# Altium schematic sheet PSU.SchDoc: Power Supply
size 297 x 209 mm; DocumentNumber: SP-0333; SheetNumber: 3; SheetTotal: 5
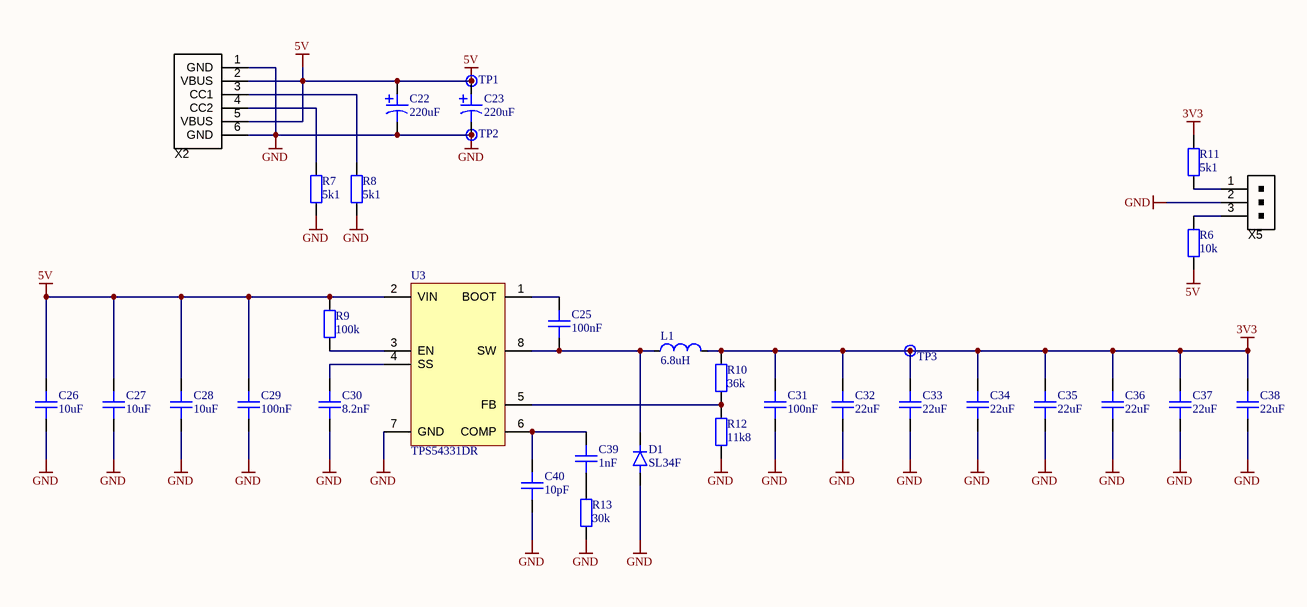
[diagram p0: PSU.SchDoc]

## Parts
C22  220uF  [CAP-TANT-D]
C23  220uF  [CAP-TANT-D]
C25  100nF  [CAP-0603]
C26  10uF  [CAP-0805]
C27  10uF  [CAP-0805]
C28  10uF  [CAP-0805]
C29  100nF  [CAP-0805]
C30  8.2nF  [CAP-0603]
C31  100nF  [CAP-0805]
C32  22uF  [CAP-0805]
C33  22uF  [CAP-0805]
C34  22uF  [CAP-0805]
C35  22uF  [CAP-0805]
C36  22uF  [CAP-0805]
C37  22uF  [CAP-0805]
C38  22uF  [CAP-0805]
C39  1nF  [CAP-0603]
C40  10pF  [CAP-0603]
D1  SL34F  [D-SMAF]
L1  6.8uH  [IND-SMD-6.5x6.5mm]
R6  10k  [RES-0603]
R7  5k1  [RES-0603]
R8  5k1  [RES-0603]
R9  100k  [RES-0603]
R10  36k  [RES-0603]
R11  5k1  [RES-0603]
R12  11k8  [RES-0603]
R13  30k  [RES-0603]
TP1  MISC - Testpoint SMT  [MISC-TESTPOINT-SMT]  (value not drawn)  (no BOM)
TP2  MISC - Testpoint SMT  [MISC-TESTPOINT-SMT]  (value not drawn)  (no BOM)
TP3  MISC - Testpoint SMT  [MISC-TESTPOINT-SMT]  (value not drawn)  (no BOM)
U3  TPS54331DR  [IC-SOIC-8]
X2  CONN - USB-C  [CONN-USB-C]  (value not drawn)
X5  CONN - 3P - THT-JST 1.5mm  [CONN-3P-THT-JST 1.5mm]  (value not drawn)

## Nets
3V3: C31.2 C32.2 C33.2 C34.2 C35.2 C36.2 C37.2 C38.2 L1.2 R10.2 R11.2 TP3.1
5V: C22.2 C23.2 C26.2 C27.2 C28.2 C29.2 R6.2 R9.1 TP1.1 U3.2(VIN) X2.2(VBUS) X2.5(VBUS)
GND: C22.1 C23.1 C26.1 C27.1 C28.1 C29.1 C30.1 C31.1 C32.1 C33.1 C34.1 C35.1 C36.1 C37.1 C38.1 C40.1 D1.1 R7.1 R8.1 R12.1 R13.1 TP2.1 U3.7(GND) X2.1(GND) X2.6(GND) X5.2
NetC25_1: C25.1 D1.2 L1.1 U3.8(SW)
NetC25_2: C25.2 U3.1(BOOT)
NetC30_2: C30.2 U3.4(SS)
NetC39_1: C39.1 R13.2
NetC39_2: C39.2 C40.2 U3.6(COMP)
NetR6_1: R6.1 X5.3
NetR7_2: R7.2 X2.4(CC2)
NetR8_2: R8.2 X2.3(CC1)
NetR9_2: R9.2 U3.3(EN)
NetR10_1: R10.1 R12.2 U3.5(FB)
NetR11_1: R11.1 X5.1

## Notes on the sheet
- PROJECT NAME
- DATE
- TITLE
- TIME
- VERSION CONTROL
- N/A
- SIZE
- SCALE:
- A4
- FILE NAME
- DWG NO.
- SHEET
- REV
- OF
- DRAWN BY:

## Library data of the parts
C22 C23 = CAP - TANT - D: Capacitor Polar; Distributor: Lomex; Order number: 92-01-29; Value: 220uF
C25 C30 C39 C40 = CAP - 0603: Capacitor Non-Polar; Distributor: *; Order number: *
  C25: Value: 100nF
  C30: Value: 8.2nF
  C39: Value: 1nF
  C40: Value: 10pF
C26-C29 C31-C38 = CAP - 0805: Capacitor Non-Polar; Distributor: *; Order number: *
  C26-C28: Value: 10uF
  C29 C31: Value: 100nF
  C32-C38: Value: 22uF
D1 = D - SL34F: 3A 600V DO-214AB RECT.SUP.FAST trr<35ns ES3J; PartNumber: SL34F; Distributor: Lomex; Order number: 83-07-60
L1 = IND - SMD: 12.7x12.7mm choke inductor; Order number: 100.434.72; 93-03-26; Value: 6.8uH; Distributor: Hestore; Lomex
R6-R13 = RES - 0603: Resistor; Distributor: *; Order number: *
  R6: Value: 10k
  R7 R8 R11: Value: 5k1
  R9: Value: 100k
  R10: Value: 36k
  R12: Value: 11k8
  R13: Value: 30k
TP1-TP3 = MISC - Testpoint SMT: SMT testpoint
U3 = IC - TPS54331: 3-A, 28-V Input, Step Down DC-DC Converter With Eco-mode; Order number: 100.408.80; Distributor: Hestore; Supplier 1: Mouser; Supplier Part Number 1: 595-TPS54331DR
X2 = CONN - USB-C: USB-C connector, power supply only; Order number: 100.469.71; ComponentLink1Description: DataSheet; Distributor: Hestore
X5 = CONN - 3P - THT-JST 1.5mm: 1x3 pin header; Distributor: *; Order number: *